# Altium project 474084-L.PrjPcb
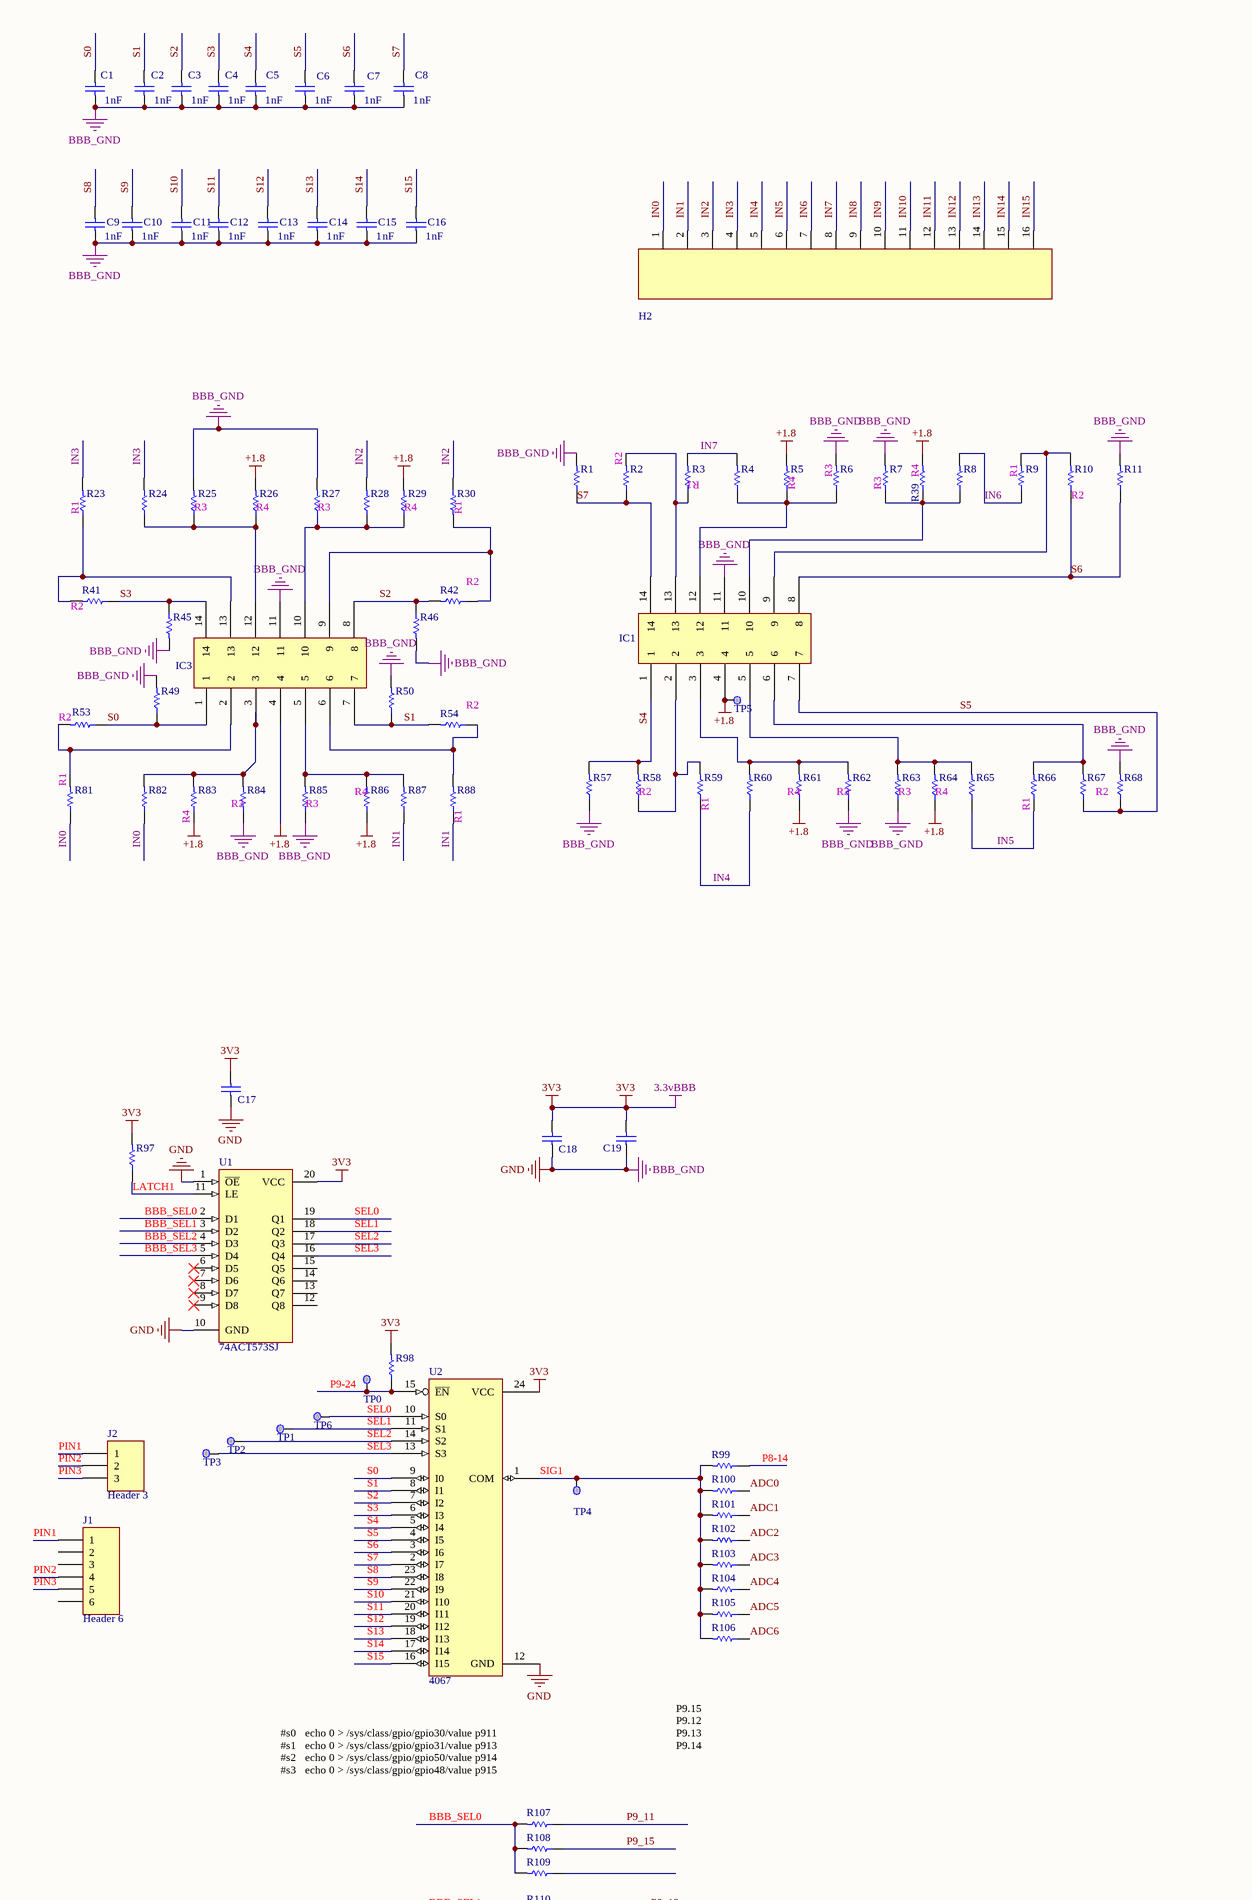
[diagram p0: BBB_ADC7_inputs_with_mux_Ver1 Rev1.SchDoc, top left]
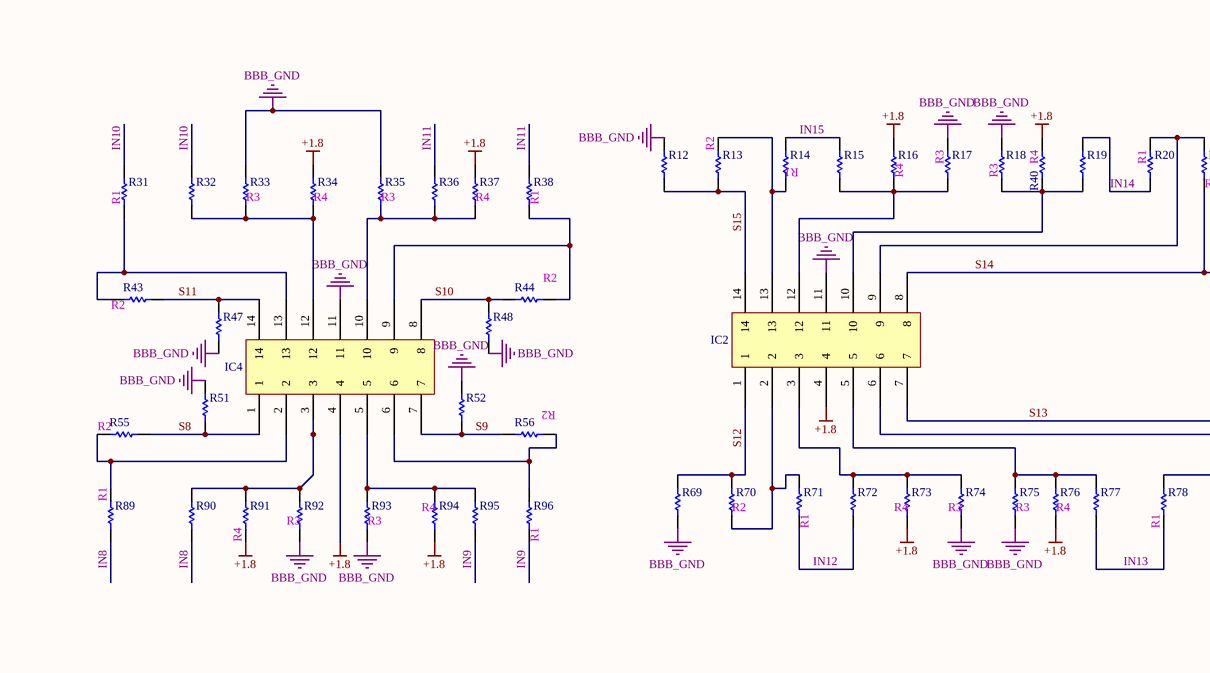
[diagram p1: BBB_ADC7_inputs_with_mux_Ver1 Rev1.SchDoc, top middle]
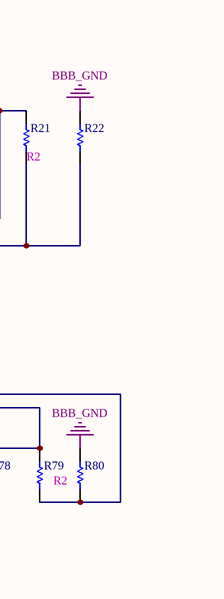
[diagram p2: BBB_ADC7_inputs_with_mux_Ver1 Rev1.SchDoc, top right]
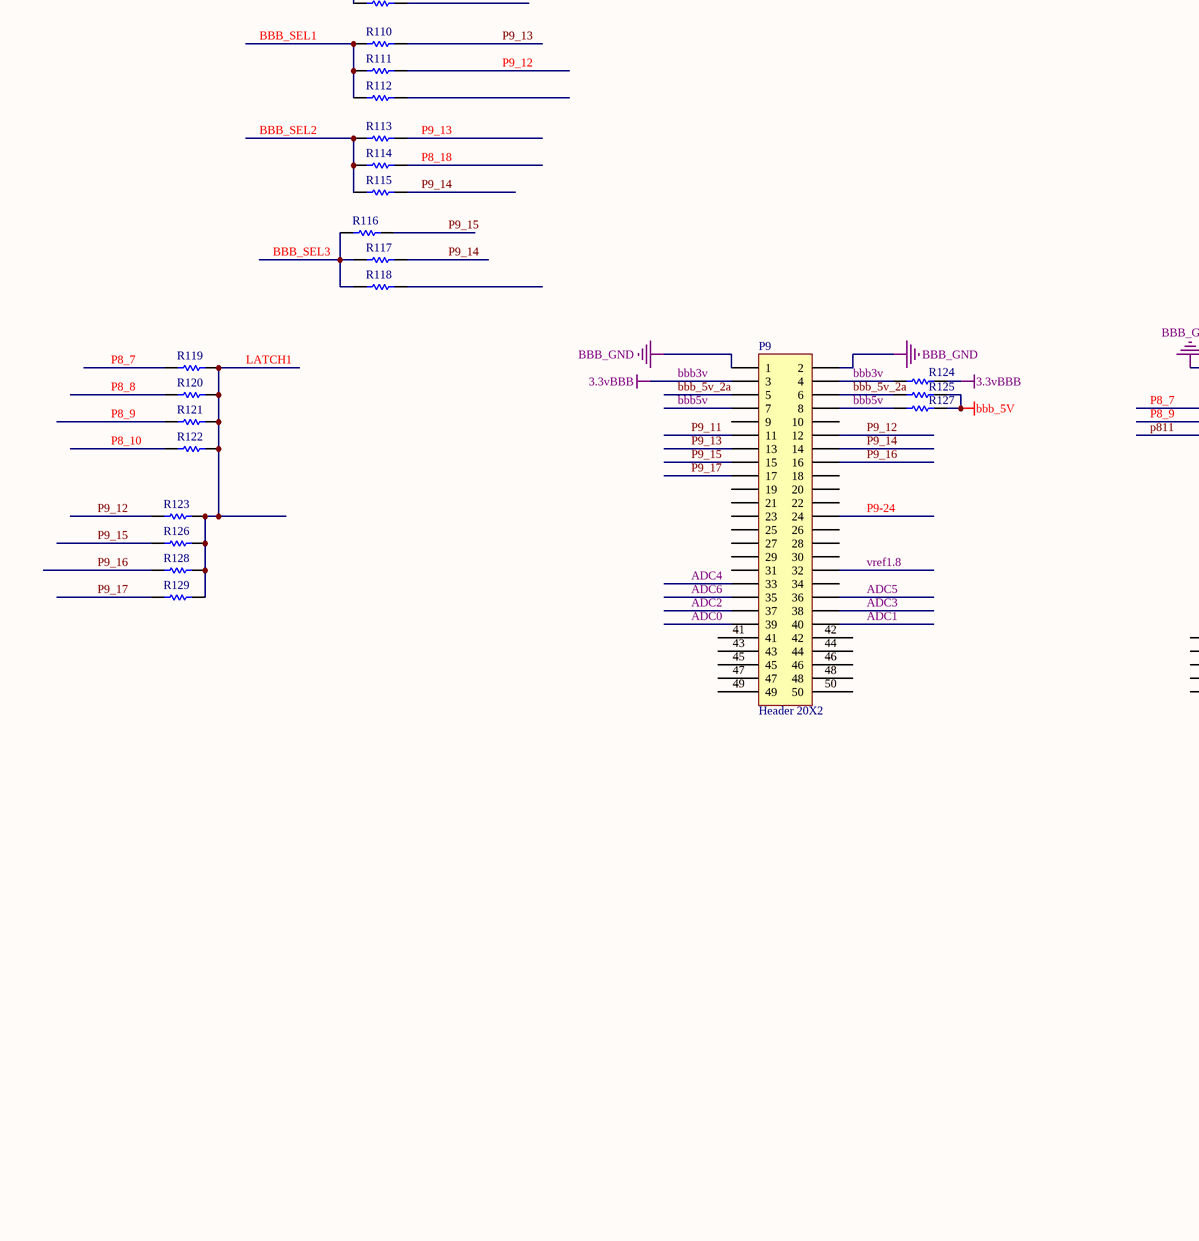
[diagram p3: BBB_ADC7_inputs_with_mux_Ver1 Rev1.SchDoc, bottom left]
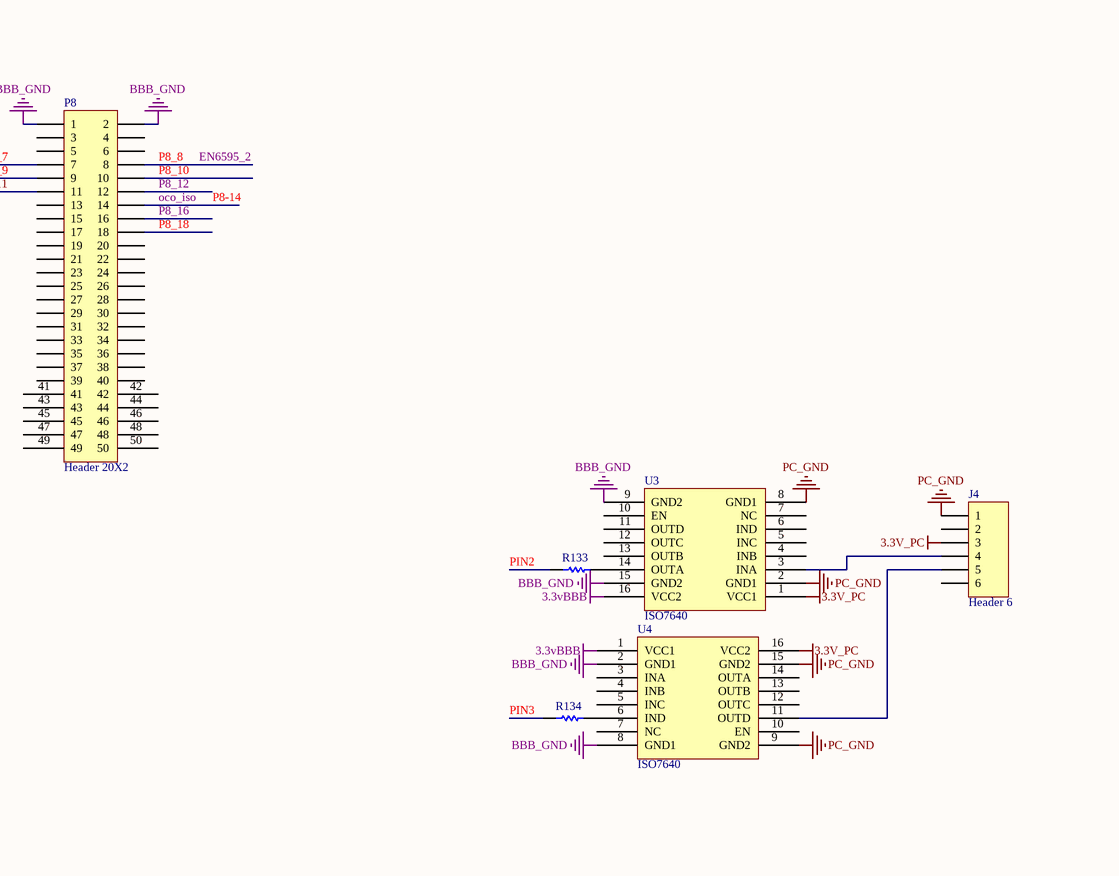
[diagram p4: BBB_ADC7_inputs_with_mux_Ver1 Rev1.SchDoc, bottom middle]
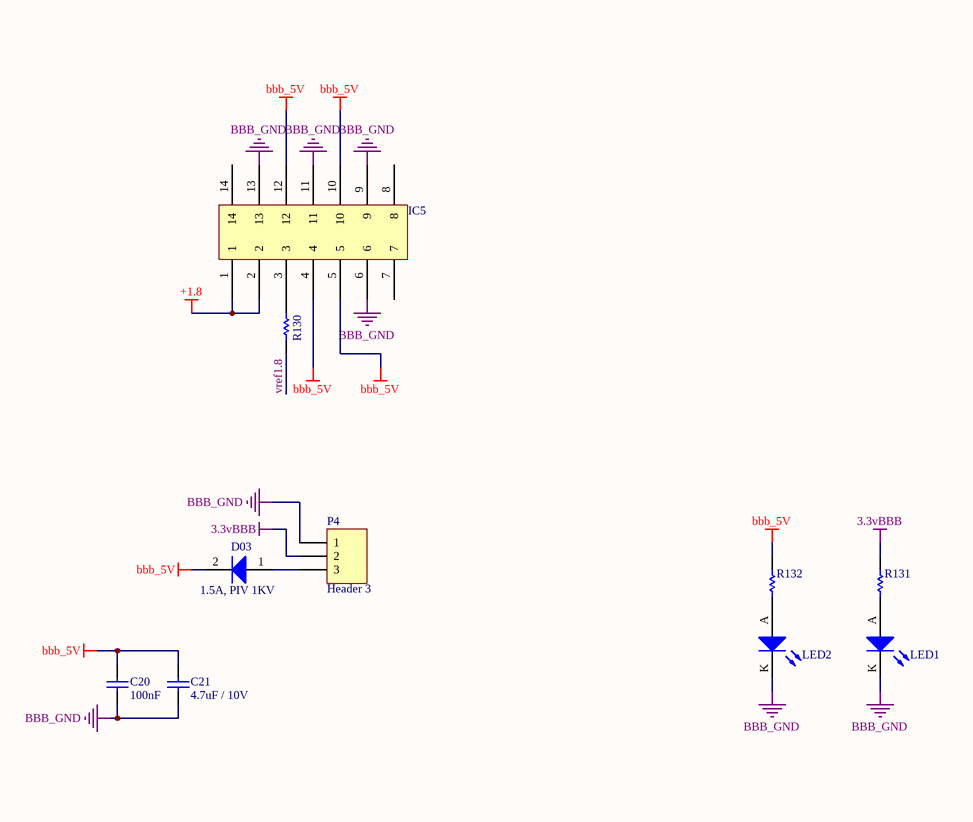
[diagram p5: BBB_ADC7_inputs_with_mux_Ver1 Rev1.SchDoc, bottom right]
1 sheet, 181 parts. Net scope: global (net labels, ports and power ports of the same name join across sheets).
Board file: BBB_ADC7_inputs_with_mux_Ver1 Rev1.PcbDoc

## Sheet BBB_ADC7_inputs_with_mux_Ver1 Rev1.SchDoc
size E

### Parts
C1  Units of Capacitance: nF  Capacitance: 1  [C0402]  (hidden comment: CAPACITOR NONPOLAR SMT)
C2  Units of Capacitance: nF  Capacitance: 1  [C0402]  (hidden comment: CAPACITOR NONPOLAR SMT)
C3  Units of Capacitance: nF  Capacitance: 1  [C0402]  (hidden comment: CAPACITOR NONPOLAR SMT)
C4  Units of Capacitance: nF  Capacitance: 1  [C0402]  (hidden comment: CAPACITOR NONPOLAR SMT)
C5  Units of Capacitance: nF  Capacitance: 1  [C0402]  (hidden comment: CAPACITOR NONPOLAR SMT)
C6  Units of Capacitance: nF  Capacitance: 1  [C0402]  (hidden comment: CAPACITOR NONPOLAR SMT)
C7  Units of Capacitance: nF  Capacitance: 1  [C0402]  (hidden comment: CAPACITOR NONPOLAR SMT)
C8  Units of Capacitance: nF  Capacitance: 1  [C0402]  (hidden comment: CAPACITOR NONPOLAR SMT)
C9  Units of Capacitance: nF  Capacitance: 1  [C0402]  (hidden comment: CAPACITOR NONPOLAR SMT)
C10  Units of Capacitance: nF  Capacitance: 1  [C0402]  (hidden comment: CAPACITOR NONPOLAR SMT)
C11  Units of Capacitance: nF  Capacitance: 1  [C0402]  (hidden comment: CAPACITOR NONPOLAR SMT)
C12  Units of Capacitance: nF  Capacitance: 1  [C0402]  (hidden comment: CAPACITOR NONPOLAR SMT)
C13  Units of Capacitance: nF  Capacitance: 1  [C0402]  (hidden comment: CAPACITOR NONPOLAR SMT)
C14  Units of Capacitance: nF  Capacitance: 1  [C0402]  (hidden comment: CAPACITOR NONPOLAR SMT)
C15  Units of Capacitance: nF  Capacitance: 1  [C0402]  (hidden comment: CAPACITOR NONPOLAR SMT)
C16  Units of Capacitance: nF  Capacitance: 1  [C0402]  (hidden comment: CAPACITOR NONPOLAR SMT)
C17  4.7uF, 10V  [C0603]  (value not drawn)
C18  4.7uF, 10V  [C0603]  (value not drawn)
C19  4.7uF, 10V  [C0603]  (value not drawn)
C20  100nF  [C0603]
C21  4.7uF / 10V  [C0603]
D03  1.5A, PIV 1KV  [DIODE_DO-214AA(SMB)]
H2  connector 16 pin male_ stright  [16 pin male stright]  (value not drawn)
IC1  OPamp  [SOIC-14]  (value not drawn)
IC2  OPamp  [SOIC-14]  (value not drawn)
IC3  OPamp  [SOIC-14]  (value not drawn)
IC4  OPamp  [SOIC-14]  (value not drawn)
IC5  OPamp  [SOIC-14]  (value not drawn)
J1  Header 6  [HDR1X6]
J2  Header 3  [HDR1X3]
J4  Header 6  [HDR1X6]
LED1  LED  [0537, LED, 1206]  (value not drawn)
LED2  LED  [0537, LED, 1206]  (value not drawn)
P4  Header 3  [HDR1X3]
P8  Header 20X2  [BBBHEADERNOHOLE]
P9  Header 20X2  [BBBHEADERNOHOLE]
R1  Resistor SMD 0603, 100 k Ohm, +/-5%, 1/10W  [0603]  (value not drawn)
R2  Resistor SMD 0603, 1.5 k Ohm, +/-5%, 1/10W  [0603]  (value not drawn)
R3  Resistor SMD 0603, 9.1 k Ohm, +/-5%, 1/10W  [0603]  (value not drawn)
R4  open  [0603]  (value not drawn)
R5  Resistor SMD 0603, 6.8 k Ohm, +/-1%, 1/10W  [0603]  (value not drawn)
R6  Resistor SMD 0603, 4.7 k Ohm, +/-5%, 1/10W  [0603]  (value not drawn)
R7  Resistor SMD 0603, 4.7 k Ohm, +/-5%, 1/10W  [0603]  (value not drawn)
R8  open  [0603]  (value not drawn)
R9  Resistor SMD 0603, 9.1 k Ohm, +/-5%, 1/10W  [0603]  (value not drawn)
R10  Resistor SMD 0603, 1.5 k Ohm, +/-5%, 1/10W  [0603]  (value not drawn)
R11  Resistor SMD 0603, 100 k Ohm, +/-5%, 1/10W  [0603]  (value not drawn)
R12  Resistor SMD 0603, 100 k Ohm, +/-5%, 1/10W  [0603]  (value not drawn)
R13  Resistor SMD 0603, 1.5 k Ohm, +/-5%, 1/10W  [0603]  (value not drawn)
R14  Resistor SMD 0603, 9.1 k Ohm, +/-5%, 1/10W  [0603]  (value not drawn)
R15  open  [0603]  (value not drawn)
R16  Resistor SMD 0603, 6.8 k Ohm, +/-1%, 1/10W  [0603]  (value not drawn)
R17  Resistor SMD 0603, 4.7 k Ohm, +/-5%, 1/10W  [0603]  (value not drawn)
R18  Resistor SMD 0603, 4.7 k Ohm, +/-5%, 1/10W  [0603]  (value not drawn)
R19  open  [0603]  (value not drawn)
R20  Resistor SMD 0603, 9.1 k Ohm, +/-5%, 1/10W  [0603]  (value not drawn)
R21  Resistor SMD 0603, 1.5 k Ohm, +/-5%, 1/10W  [0603]  (value not drawn)
R22  Resistor SMD 0603, 100 k Ohm, +/-5%, 1/10W  [0603]  (value not drawn)
R23  Resistor SMD 0603, 9.1 k Ohm, +/-5%, 1/10W  [0603]  (value not drawn)
R24  OPEN  [0603]  (value not drawn)
R25  Resistor SMD 0603, 4.7 k Ohm, +/-5%, 1/10W  [0603]  (value not drawn)
R26  Resistor SMD 0603, 6.8 k Ohm, +/-1%, 1/10W  [0603]  (value not drawn)
R27  Resistor SMD 0603, 4.7 k Ohm, +/-5%, 1/10W  [0603]  (value not drawn)
R28  OPEN  [0603]  (value not drawn)
R29  Resistor SMD 0603, 6.8 k Ohm, +/-1%, 1/10W  [0603]  (value not drawn)
R30  Resistor SMD 0603, 9.1 k Ohm, +/-5%, 1/10W  [0603]  (value not drawn)
R31  Resistor SMD 0603, 9.1 k Ohm, +/-5%, 1/10W  [0603]  (value not drawn)
R32  OPEN  [0603]  (value not drawn)
R33  Resistor SMD 0603, 4.7 k Ohm, +/-5%, 1/10W  [0603]  (value not drawn)
R34  Resistor SMD 0603, 6.8 k Ohm, +/-1%, 1/10W  [0603]  (value not drawn)
R35  Resistor SMD 0603, 4.7 k Ohm, +/-5%, 1/10W  [0603]  (value not drawn)
R36  OPEN  [0603]  (value not drawn)
R37  Resistor SMD 0603, 6.8 k Ohm, +/-1%, 1/10W  [0603]  (value not drawn)
R38  Resistor SMD 0603, 9.1 k Ohm, +/-5%, 1/10W  [0603]  (value not drawn)
R39  Resistor SMD 0603, 6.8 k Ohm, +/-1%, 1/10W  [0603]  (value not drawn)
R40  Resistor SMD 0603, 6.8 k Ohm, +/-1%, 1/10W  [0603]  (value not drawn)
R41  Resistor SMD 0603, 1.5 k Ohm, +/-5%, 1/10W  [0603]  (value not drawn)
R42  Resistor SMD 0603, 1.5 k Ohm, +/-5%, 1/10W  [0603]  (value not drawn)
R43  Resistor SMD 0603, 1.5 k Ohm, +/-5%, 1/10W  [0603]  (value not drawn)
R44  Resistor SMD 0603, 1.5 k Ohm, +/-5%, 1/10W  [0603]  (value not drawn)
R45  Resistor SMD 0603, 100 k Ohm, +/-5%, 1/10W  [0603]  (value not drawn)
R46  Resistor SMD 0603, 100 k Ohm, +/-5%, 1/10W  [0603]  (value not drawn)
R47  Resistor SMD 0603, 100 k Ohm, +/-5%, 1/10W  [0603]  (value not drawn)
R48  Resistor SMD 0603, 100 k Ohm, +/-5%, 1/10W  [0603]  (value not drawn)
R49  Resistor SMD 0603, 100 k Ohm, +/-5%, 1/10W  [0603]  (value not drawn)
R50  Resistor SMD 0603, 100 k Ohm, +/-5%, 1/10W  [0603]  (value not drawn)
R51  Resistor SMD 0603, 100 k Ohm, +/-5%, 1/10W  [0603]  (value not drawn)
R52  Resistor SMD 0603, 100 k Ohm, +/-5%, 1/10W  [0603]  (value not drawn)
R53  Resistor SMD 0603, 1.5 k Ohm, +/-5%, 1/10W  [0603]  (value not drawn)
R54  Resistor SMD 0603, 1.5 k Ohm, +/-5%, 1/10W  [0603]  (value not drawn)
R55  Resistor SMD 0603, 1.5 k Ohm, +/-5%, 1/10W  [0603]  (value not drawn)
R56  Resistor SMD 0603, 1.5 k Ohm, +/-5%, 1/10W  [0603]  (value not drawn)
R57  Resistor SMD 0603, 100 k Ohm, +/-5%, 1/10W  [0603]  (value not drawn)
R58  Resistor SMD 0603, 1.5 k Ohm, +/-5%, 1/10W  [0603]  (value not drawn)
R59  Resistor SMD 0603, 9.1 k Ohm, +/-5%, 1/10W  [0603]  (value not drawn)
R60  open  [0603]  (value not drawn)
R61  Resistor SMD 0603, 6.8 k Ohm, +/-1%, 1/10W  [0603]  (value not drawn)
R62  Resistor SMD 0603, 4.7 k Ohm, +/-5%, 1/10W  [0603]  (value not drawn)
R63  Resistor SMD 0603, 4.7 k Ohm, +/-5%, 1/10W  [0603]  (value not drawn)
R64  Resistor SMD 0603, 6.8 k Ohm, +/-1%, 1/10W  [0603]  (value not drawn)
R65  open  [0603]  (value not drawn)
R66  Resistor SMD 0603, 9.1 k Ohm, +/-5%, 1/10W  [0603]  (value not drawn)
R67  Resistor SMD 0603, 1.5 k Ohm, +/-5%, 1/10W  [0603]  (value not drawn)
R68  Resistor SMD 0603, 100 k Ohm, +/-5%, 1/10W  [0603]  (value not drawn)
R69  Resistor SMD 0603, 100 k Ohm, +/-5%, 1/10W  [0603]  (value not drawn)
R70  Resistor SMD 0603, 1.5 k Ohm, +/-5%, 1/10W  [0603]  (value not drawn)
R71  Resistor SMD 0603, 9.1 k Ohm, +/-5%, 1/10W  [0603]  (value not drawn)
R72  open  [0603]  (value not drawn)
R73  Resistor SMD 0603, 6.8 k Ohm, +/-1%, 1/10W  [0603]  (value not drawn)
R74  Resistor SMD 0603, 4.7 k Ohm, +/-5%, 1/10W  [0603]  (value not drawn)
R75  Resistor SMD 0603, 4.7 k Ohm, +/-5%, 1/10W  [0603]  (value not drawn)
R76  Resistor SMD 0603, 6.8 k Ohm, +/-1%, 1/10W  [0603]  (value not drawn)
R77  open  [0603]  (value not drawn)
R78  Resistor SMD 0603, 9.1 k Ohm, +/-5%, 1/10W  [0603]  (value not drawn)
R79  Resistor SMD 0603, 1.5 k Ohm, +/-5%, 1/10W  [0603]  (value not drawn)
R80  Resistor SMD 0603, 100 k Ohm, +/-5%, 1/10W  [0603]  (value not drawn)
R81  Resistor SMD 0603, 9.1 k Ohm, +/-5%, 1/10W  [0603]  (value not drawn)
R82  OPEN  [0603]  (value not drawn)
R83  Resistor SMD 0603, 6.8 k Ohm, +/-1%, 1/10W  [0603]  (value not drawn)
R84  Resistor SMD 0603, 4.7 k Ohm, +/-5%, 1/10W  [0603]  (value not drawn)
R85  Resistor SMD 0603, 4.7 k Ohm, +/-5%, 1/10W  [0603]  (value not drawn)
R86  Resistor SMD 0603, 6.8 k Ohm, +/-1%, 1/10W  [0603]  (value not drawn)
R87  OPEN  [0603]  (value not drawn)
R88  Resistor SMD 0603, 9.1 k Ohm, +/-5%, 1/10W  [0603]  (value not drawn)
R89  Resistor SMD 0603, 9.1 k Ohm, +/-5%, 1/10W  [0603]  (value not drawn)
R90  OPEN  [0603]  (value not drawn)
R91  Resistor SMD 0603, 6.8 k Ohm, +/-1%, 1/10W  [0603]  (value not drawn)
R92  Resistor SMD 0603, 4.7 k Ohm, +/-5%, 1/10W  [0603]  (value not drawn)
R93  Resistor SMD 0603, 4.7 k Ohm, +/-5%, 1/10W  [0603]  (value not drawn)
R94  Resistor SMD 0603, 6.8 k Ohm, +/-1%, 1/10W  [0603]  (value not drawn)
R95  OPEN  [0603]  (value not drawn)
R96  Resistor SMD 0603, 9.1 k Ohm, +/-5%, 1/10W  [0603]  (value not drawn)
R97  (no value)  [0603]
R98  1Kohm  [0603]  (value not drawn)
R99  1Kohm  [0603]  (value not drawn)
R100  1Kohm  [0603]  (value not drawn)
R101  1Kohm  [0603]  (value not drawn)
R102  1Kohm  [0603]  (value not drawn)
R103  1Kohm  [0603]  (value not drawn)
R104  1Kohm  [0603]  (value not drawn)
R105  1Kohm  [0603]  (value not drawn)
R106  1Kohm  [0603]  (value not drawn)
R107  (no value)  [0603]
R108  (no value)  [0603]
R109  (no value)  [0603]
R110  (no value)  [0603]
R111  (no value)  [0603]
R112  (no value)  [0603]
R113  (no value)  [0603]
R114  (no value)  [0603]
R115  (no value)  [0603]
R116  (no value)  [0603]
R117  (no value)  [0603]
R118  (no value)  [0603]
R119  1Kohm  [0603]  (value not drawn)
R120  1Kohm  [0603]  (value not drawn)
R121  1Kohm  [0603]  (value not drawn)
R122  1Kohm  [0603]  (value not drawn)
R123  1Kohm  [0603]  (value not drawn)
R124  Resistor SMD 0603, 0 Ohm, +/-5%, 1/10W  [0603]  (value not drawn)
R125  Resistor SMD 0603, 0 Ohm, +/-5%, 1/10W  [0603]  (value not drawn)
R126  1Kohm  [0603]  (value not drawn)
R127  Resistor SMD 0603, 0 Ohm, +/-5%, 1/10W  [0603]  (value not drawn)
R128  1Kohm  [0603]  (value not drawn)
R129  1Kohm  [0603]  (value not drawn)
R130  Resistor SMD 0603, 0 Ohm, +/-5%, 1/10W  [0603]  (value not drawn)
R131  Resistor SMD 0603, 4.7 k Ohm, +/-5%, 1/10W  [0603]  (value not drawn)
R132  Resistor SMD 0603, 4.7 k Ohm, +/-5%, 1/10W  [0603]  (value not drawn)
R133  Resistor SMD 0603, 0 Ohm, +/-5%, 1/10W  [0603]  (value not drawn)
R134  Resistor SMD 0603, 0 Ohm, +/-5%, 1/10W  [0603]  (value not drawn)
TP0  TEST PAD  [TP]  (value not drawn)
TP1  TEST PAD  [TP]  (value not drawn)
TP2  TEST PAD  [TP]  (value not drawn)
TP3  TEST PAD  [TP]  (value not drawn)
TP4  TEST PAD  [TP]  (value not drawn)
TP5  TEST PAD  [TP]  (value not drawn)
TP6  TEST PAD  [TP]  (value not drawn)
U1  74ACT573SJ  [sol-20]
U2  4067  [SSOP-24]
U3  ISO7640  [SOIC-16]
U4  ISO7640  [SOIC-16]

### Nets
3.3V_PC: J4.3 U3.1(VCC1) U4.16(VCC2)
+1.8: IC1.4 IC2.4 IC3.4 IC4.4 IC5.1 IC5.2 R5.2 R16.2 R26.2 R29.2 R34.2 R37.2 R39.2 R40.2 R61.1 R64.1 R73.1 R76.1 R83.1 R86.1 R91.1 R94.1 TP5.1
bbb3v: C17.1 C18.1 C19.1 P4.2 P9.3 P9.4 R97.2 R98.2 R124.1 R124.2 R131.2 U1.20(VCC) U2.24(VCC) U3.16(VCC2) U4.1(VCC1)  [also labelled 3.3vBBB, 3V3]
bbb_5V: C20.1 C21.1 D03.2 IC5.4 IC5.5 IC5.10 IC5.12 R125.1 R127.1 R132.2
BBB_GND: C1.2 C2.2 C3.2 C4.2 C5.2 C6.2 C7.2 C8.2 C9.2 C10.2 C11.2 C12.2 C13.2 C14.2 C15.2 C16.2 C17.2 C18.2 C19.2 C20.2 C21.2 IC1.11 IC2.11 IC3.11 IC4.11 IC5.6 IC5.9 IC5.11 IC5.13 LED1.K LED2.K P4.1 P8.1 P8.2 P9.1 P9.2 R1.2 R6.2 R7.2 R11.2 R12.2 R17.2 R18.2 R22.2 R25.2 R27.2 R33.2 R35.2 R45.2 R46.2 R47.2 R48.2 R49.2 R50.2 R51.2 R52.2 R57.1 R62.1 R63.1 R68.2 R69.1 R74.1 R75.1 R80.2 R84.1 R85.1 R92.1 R93.1 U1.1(~{OE}) U1.10(GND) U2.12(GND) U3.9(GND2) U3.15(GND2) U4.2(GND1) U4.8(GND1)  [also labelled GND]
PC_GND: J4.1 U3.2(GND1) U3.8(GND1) U4.9(GND2) U4.15(GND2)
ADC0: P9.39 R100.1
ADC1: P9.40 R101.1
ADC2: P9.37 R102.1
ADC3: P9.38 R103.1
ADC4: P9.33 R104.1
ADC5: P9.36 R105.1
ADC6: P9.35 R106.1
bbb5v: P9.7 P9.8 R127.2
bbb_5v_2a: P9.5 P9.6 R125.2
BBB_SEL0: R107.2 R108.2 R109.2 U1.2(D1)
BBB_SEL1: R110.2 R111.2 R112.2 U1.3(D2)
BBB_SEL2: R113.2 R114.2 R115.2 U1.4(D3)
BBB_SEL3: R116.2 R117.2 R118.2 U1.5(D4)
EN6595_2: P8.8 R120.2  [also labelled P8_8]
IN0: H2.1 R81.1 R82.1
IN1: H2.2 R87.1 R88.1
IN2: H2.3 R28.2 R30.1
IN3: H2.4 R23.2 R24.2
IN4: H2.5 R59.1 R60.1
IN5: H2.6 R65.1 R66.1
IN6: H2.7 R8.2 R9.1
IN7: H2.8 R3.2 R4.2
IN8: H2.9 R89.1 R90.1
IN9: H2.10 R95.1 R96.1
IN10: H2.11 R31.2 R32.2
IN11: H2.12 R36.2 R38.1
IN12: H2.13 R71.1 R72.1
IN13: H2.14 R77.1 R78.1
IN14: H2.15 R19.2 R20.1
IN15: H2.16 R14.2 R15.2
LATCH1: R97.1 R119.1 R120.1 R121.1 R122.1 R123.1 R126.1 R128.1 R129.1 U1.11(LE)
oco_iso: P8.14 R99.1  [also labelled P8-14]
P8_7: P8.7 R119.2
P8_9: P8.9 R121.2
P8_10: P8.10 R122.2
P8_12: P8.12
P8_16: P8.16
P8_18: P8.18 R114.1
P9-24: P9.24 R98.1 TP0.1 U2.15(~{EN})
P9_11: P9.11 R107.1
P9_12: P9.12 R111.1 R123.2
P9_13: P9.13 R110.1 R113.1
P9_14: P9.14 R115.1 R117.1
P9_15: P9.15 R108.1 R116.1 R126.2
P9_16: P9.16 R128.2
P9_17: P9.17 R129.2
p811: P8.11
PIN1: J1.1 J2.1
PIN2: J1.4 J2.2 R133.2
PIN3: J1.5 J2.3 R134.2
S0: C1.1 IC3.1 R49.1 R53.1 U2.9(I0)
S1: C2.1 IC3.7 R50.1 R54.2 U2.8(I1)
S2: C3.1 IC3.8 R42.2 R46.1 U2.7(I2)
S3: C4.1 IC3.14 R41.1 R45.1 U2.6(I3)
S4: C5.1 IC1.1 R57.2 R58.2 U2.5(I4)
S5: C6.1 IC1.7 R67.1 R68.1 U2.4(I5)
S6: C7.1 IC1.8 R10.1 R11.1 U2.3(I6)
S7: C8.1 IC1.14 R1.1 R2.1 U2.2(I7)
S8: C9.1 IC4.1 R51.1 R55.1 U2.23(I8)
S9: C10.1 IC4.7 R52.1 R56.2 U2.22(I9)
S10: C11.1 IC4.8 R44.2 R48.1 U2.21(I10)
S11: C12.1 IC4.14 R43.1 R47.1 U2.20(I11)
S12: C13.1 IC2.1 R69.2 R70.2 U2.19(I12)
S13: C14.1 IC2.7 R79.1 R80.1 U2.18(I13)
S14: C15.1 IC2.8 R21.1 R22.1 U2.17(I14)
S15: C16.1 IC2.14 R12.1 R13.1 U2.16(I15)
SEL0: TP6.1 U1.19(Q1) U2.10(S0)
SEL1: TP1.1 U1.18(Q2) U2.11(S1)
SEL2: TP2.1 U1.17(Q3) U2.14(S2)
SEL3: TP3.1 U1.16(Q4) U2.13(S3)
SIG1: R99.2 R100.2 R101.2 R102.2 R103.2 R104.2 R105.2 R106.2 TP4.1 U2.1(COM)
vref1.8: P9.32 R130.1
NetD03_1: D03.1 P4.3
NetIC1_2: IC1.2 R58.1 R59.2
NetIC1_3: IC1.3 R60.2 R61.2 R62.2
NetIC1_5: IC1.5 R63.2 R64.2 R65.2
NetIC1_6: IC1.6 R66.2 R67.2
NetIC1_9: IC1.9 R9.2 R10.2
NetIC1_10: IC1.10 R7.1 R8.1 R39.1
NetIC1_12: IC1.12 R4.1 R5.1 R6.1
NetIC1_13: IC1.13 R2.2 R3.1
NetIC2_2: IC2.2 R70.1 R71.2
NetIC2_3: IC2.3 R72.2 R73.2 R74.2
NetIC2_5: IC2.5 R75.2 R76.2 R77.2
NetIC2_6: IC2.6 R78.2 R79.2
NetIC2_9: IC2.9 R20.2 R21.2
NetIC2_10: IC2.10 R18.1 R19.1 R40.1
NetIC2_12: IC2.12 R15.1 R16.1 R17.1
NetIC2_13: IC2.13 R13.2 R14.1
NetIC3_2: IC3.2 R53.2 R81.2
NetIC3_3: IC3.3 R82.2 R83.2 R84.2
NetIC3_5: IC3.5 R85.2 R86.2 R87.2
NetIC3_6: IC3.6 R54.1 R88.2
NetIC3_9: IC3.9 R30.2 R42.1
NetIC3_10: IC3.10 R27.1 R28.1 R29.1
NetIC3_12: IC3.12 R24.1 R25.1 R26.1
NetIC3_13: IC3.13 R23.1 R41.2
NetIC4_2: IC4.2 R55.2 R89.2
NetIC4_3: IC4.3 R90.2 R91.2 R92.2
NetIC4_5: IC4.5 R93.2 R94.2 R95.2
NetIC4_6: IC4.6 R56.1 R96.2
NetIC4_9: IC4.9 R38.2 R44.1
NetIC4_10: IC4.10 R35.1 R36.1 R37.1
NetIC4_12: IC4.12 R32.1 R33.1 R34.1
NetIC4_13: IC4.13 R31.1 R43.2
NetIC5_3: IC5.3 R130.2
NetJ4_4: J4.4 U3.3(INA)
NetJ4_5: J4.5 U4.11(OUTD)
NetLED1_A: LED1.A R131.1
NetLED2_A: LED2.A R132.1
NetR133_1: R133.1 U3.14(OUTA)
NetR134_1: R134.1 U4.6(IND)

Not connected (* = marked no-connect by the designer): IC5 7 8 14; J1 2 3 6; J4 2 6; P8 3 4 5 6 13 15 17 19 20 21 22 23 24 25 26 27 28 29 30 31 32 33 34 35 36 37 38 39 40 41 42 43 44 45 46 47 48 49 50; P9 9 10 18 19 20 21 22 23 25 26 27 28 29 30 31 34 41 42 43 44 45 46 47 48 49 50; R109 1; R112 1; R118 1; U1 6(D5)* 7(D6)* 8(D7)* 9(D8)* 12(Q8) 13(Q7) 14(Q6) 15(Q5); U3 4(INB) 5(INC) 6(IND) 7(NC) 10(EN) 11(OUTD) 12(OUTC) 13(OUTB); U4 3(INA) 4(INB) 5(INC) 7(NC) 10(EN) 12(OUTC) 13(OUTB) 14(OUTA)

### Notes on the sheet
- (near R2) R2
- (near R3) R1
- (near R5) R4
- (near R6) R3
- (near R7) R3
- (near R39) R4
- (near R9) R1
- (near R10) R2
- (near R13) R2
- (near R14) R1
- (near R16) R4
- (near R17) R3
- (near R18) R3
- (near R40) R4
- (near R20) R1
- (near R21) R2
- (near R23) R1
- (near R25) R3
- (near R26) R4
- (near R27) R3
- (near R29) R4
- (near R30) R1
- (near R31) R1
- (near R33) R3
- (near R34) R4
- (near R35) R3
- (near R37) R4
- (near R38) R1
- (near R41) R2
- (near R42) R2
- (near R43) R2
- (near R44) R2
- (near R53) R2
- (near R54) R2
- (near R55) R2
- (near R56) R2
- (near R81) R1
- (near R84) R3
- (near R85) R3
- (near R86) R4
- (near R58) R2
- (near R59) R1
- (near R61) R4
- (near R62) R3
- (near R63) R3
- (near R64) R4
- (near R66) R1
- R2
- (near R89) R1
- (near R92) R3
- (near R93) R3
- (near R94) R4
- (near R70) R2
- (near R71) R1
- (near R73) R4
- (near R74) R3
- (near R75) R3
- (near R76) R4
- (near R78) R1
- (near R83) R4
- (near R88) R1
- (near R91) R4
- (near R96) R1
- (near R107) #s0   echo 0 > /sys/class/gpio/gpio30/value p911
  #s1   echo 0 > /sys/class/gpio/gpio31/value p913
  #s2   echo 0 > /sys/class/gpio/gpio50/value p914
  #s3   echo 0 > /sys/class/gpio/gpio48/value p915
- P9.15
  P9.12
  P9.13
  P9.14

### Library data of the parts
C1-C16 = BCS22A-102: Capacitor ceramic, SMD 0402, 1 nF, +/-10%, 50 V dc; Mfr Name: YAGEO; Secure Use Status: Preferred; Voltage Rating: 50; Units of Voltage: V dc; Dielectric: X7R; Value(Farad): 1n; Published: 8-Jun-2000; LatestRevisionDate: 17-Jul-2002; LatestRevisionNote: Re-released for DXP Platform.; PackageReference: C1206; Publisher: Altium Limited; SMLPARTNO: BCS22A-102; Tolerance (%): +/-10%; Application: Filtering; Coupling & Decoupling; Life Cycle: Production; Package: 0402; Mounting Type: SMD; Sub Category: Ceramic; HelpURL: http://dataudr.udp.sml.com/DataSheet/EX0351-121-R39.pdf
C17-C19 C21 = BCS129-475: Capacitor ceramic, SMD 0603, 4.7 uF, +/-10%, 10 V dc; Mfr Name: KEMET; Secure Use Status: Authorization Required; Voltage Rating: 10; Units of Voltage: V dc; Capacitance: 4.7; Dielectric: X5R; 3D Model: Not Required; Published: 8-Jun-2000; LatestRevisionDate: 17-Jul-2002; LatestRevisionNote: Re-released for DXP Platform.; PackageReference: C1206; Publisher: Altium Limited; SMLPARTNO: BCS129-475; Tolerance (%): +/-10%; Application: Filtering, Coupling & Decoupling; Life Cycle: Pur Qual; Units of Capacitance: uF; Package: 0603; Mounting Type: SMD; Sub Category: Ceramic
C20 = BCS129-104: Capacitor ceramic, SMD 0603, 100 nF, +/-10%, 16 V dc; Mfr Name: KEMET; Units of Voltage: V dc; Value(Farad): 100n; Voltage Rating: 16; Dielectric: X7R; Capacitance: 100; Published: 8-Jun-2000; LatestRevisionDate: 17-Jul-2002; LatestRevisionNote: Re-released for DXP Platform.; PackageReference: C1206; Publisher: Altium Limited; SMLPARTNO: BCS129-104; Life Cycle: Production; Package: 0603; Application: Filtering; Coupling & Decoupling; Mounting Type: SMD; Units of Capacitance: nF; Tolerance (%): +/-10%; Sub Category: Ceramic
D03 = BDS334-001: Diode high voltage, SMD DO-214AA, If 1.5 A, PIV 1 kV; Mfr Name: VISHAY; Secure Use Status: Authorization Required; Peak Inverse Voltage: 1; Average Forward Current: 1.5; Published: 8-Jun-2000; LatestRevisionDate: 17-Jul-2002; LatestRevisionNote: Re-released for DXP Platform.; PackageDocument: Sep-1996; PackageReference: SMC; Publisher: Altium Limited; Code_JEDEC: DO-214-AB; SMLPARTNO: BDS334-001; Units of Voltage: kV; Life Cycle: Production; Units of Current: A; Mounting Type: SMD; HelpURL: http://dataudr.udp.sml.com/DataSheet/EX0551-218-R00.pdf; Sub Category: High Voltage; Package: DO-214AA
IC1-IC4 = OPamp: SMLPARTNO: BIS114-020
IC5 = OPamp: SMLPPARTNO: BIS114-020
J1 J4 = Header 6: Header, 6-Pin; LatestRevisionDate: 17-Jul-2002; LatestRevisionNote: Re-released for DXP Platform.; Publisher: Altium Limited
J2 P4 = Header 3: Header, 3-Pin; LatestRevisionDate: 17-Jul-2002; LatestRevisionNote: Re-released for DXP Platform.; Publisher: Altium Limited
LED1 LED2 = BDS461-001: Optoelectronic LED, SMD 1206, red colour; Mfr Name: AVAGO TECHNOLOGIES; SMLPARTNO: BDS461-001; Life Cycle: Production; Package: 1206; Mounting Type: SMD; Sub Category: LED; Published: 8-Jun-2000; LatestRevisionDate: 08-Jul-2005; LatestRevisionNote: Mech Layer 1 removed.; PackageReference: LED-0; Publisher: Altium Limited; LED Colour: Red
P8 P9 = Header 20X2: Header, 20-Pin, Dual row; LatestRevisionDate: 17-Jul-2002; LatestRevisionNote: Re-released for DXP Platform.; Publisher: Altium Limited
R1 R11 R12 R22 R45-R52 R57 R68 R69 R80 = BRS133-473: SMLPARTNO: BRS131-104; Mfr Name: VISHAY; Sub Category: Thick Film; Tempco1: 0.0002; Unit Of Resistance: k Ohm; Value(ohm): 100; Life Cycle: Obsolete; Package: 0603; Mounting Type: SMD; Tolerance: +/-5%; Power Rating: 1/10W
R2 R13 R41-R44 R53-R56 R58 R67 R70 R79 = BRS133-473: SMLPARTNO: BRS131-152; Mfr Name: VISHAY; Sub Category: Thick Film; Tempco1: 0.0002; Unit Of Resistance: k Ohm; Value(ohm): 1.5; Life Cycle: Obsolete; Package: 0603; Mounting Type: SMD; Tolerance: +/-5%; Power Rating: 1/10W
R3 R9 R14 R20 R30 R38 R66 R78 R81 R88 R89 R96 = BRS133-473: SMLPARTNO: BRS131-912; Mfr Name: VISHAY; Sub Category: Thick Film; Tempco1: 0.0002; Unit Of Resistance: k Ohm; Value(ohm): 9.1; Life Cycle: Obsolete; Package: 0603; Mounting Type: SMD; Tolerance: +/-5%; Power Rating: 1/10W
R4 R8 R15 R19 R24 R28 R32 R36 R60 R72 R82 R87 R90 R95 = BRS133-473: Mfr Name: VISHAY; Sub Category: Thick Film; Tempco1: 0.0002; Tolerance: +/-5%; Power Rating: 1/10W; Life Cycle: Obsolete; Package: 0603; Mounting Type: SMD
R5 R16 R26 R34 R39 R40 R61 R64 R73 R76 R86 R94 = BRS133-473: SMLPARTNO: BRS131-682; Mfr Name: VISHAY; Sub Category: Thick Film; Tempco1: 0.0002; Unit Of Resistance: k Ohm; Value(ohm): 6.5; Tolerance: +/-5%; Life Cycle: Obsolete; Package: 0603; Mounting Type: SMD; Power Rating: 1/10W
R6 R7 R17 R18 R25 R27 R33 R35 R62 R63 R74 R75 R84 R85 R92 R93 = BRS133-473: SMLPARTNO: BRS133-472; Mfr Name: VISHAY; Sub Category: Thick Film; Tempco1: 0.0002; Unit Of Resistance: k Ohm; Value(ohm): 4.7; Life Cycle: Obsolete; Package: 0603; Mounting Type: SMD; Tolerance: +/-5%; Power Rating: 1/10W
R10 R21 = BRS133-473: SMLPARTNO: BRS131-152; Mfr Name: VISHAY; Sub Category: Thick Film; Resistance: 47; Tempco1: 0.0002; Unit Of Resistance: k Ohm; Value(ohm): 1.5; Life Cycle: Obsolete; Package: 0603; Mounting Type: SMD; Tolerance: +/-5%; Power Rating: 1/10W
R23 R31 = BRS133-473: SMLPARTNO: BRS131-912; Mfr Name: VISHAY; Sub Category: Thick Film; Resistance: 47; Tempco1: 0.0002; Unit Of Resistance: k Ohm; Value(ohm): 9.1; Life Cycle: Obsolete; Package: 0603; Mounting Type: SMD; Tolerance: +/-5%; Power Rating: 1/10W
R29 R37 R83 R91 = BRS133-473: SMLPARTNO: BRS131-682; Mfr Name: VISHAY; Sub Category: Thick Film; Resistance: 47; Tempco1: 0.0002; Unit Of Resistance: k Ohm; Value(ohm): 6.5; Tolerance: +/-5%; Life Cycle: Obsolete; Package: 0603; Mounting Type: SMD; Power Rating: 1/10W
R59 R71 = BRS133-473: SMLPARTNO: BRS133-902; Mfr Name: VISHAY; Sub Category: Thick Film; Tempco1: 0.0002; Unit Of Resistance: k Ohm; Value(ohm): 9.2; Life Cycle: Obsolete; Package: 0603; Mounting Type: SMD; Tolerance: +/-5%; Power Rating: 1/10W
R65 R77 = BRS133-473: Mfr Name: VISHAY; Sub Category: Thick Film; Tempco1: 0.0002; Unit Of Resistance: k Ohm; Tolerance: +/-5%; Power Rating: 1/10W; Life Cycle: Obsolete; Package: 0603; Mounting Type: SMD
R97 R107-R118 = BRS132-472: Resistor SMD 0603, 0 Ohm, +/-5%, 1/10W; SMLPARTNO: BRS132-000; Mfr Name: YAGEO; Sub Category: Thick Film; Resistance: 0; Tempco1: 0.0001; Unit Of Resistance: k Ohm; Value(ohm): 4.7k; Life Cycle: Obsolete; Package: 0603; Mounting Type: SMD; Tolerance: +/-5%; Power Rating: 1/10W
R98-R106 R119-R123 R126 R128 R129 = BRS831-102: Resistor SMD 0603, 1 k Ohm, +/-1%, 1/10W; Mfr Name: YAGEO; Sub Category: Thin Film; Resistance: 1; Tempco1: 0.00005; Unit Of Resistance: k Ohm; Value(ohm): 1k; SMLPARTNO: BRS831-102; Life Cycle: Production; Package: 0603; Mounting Type: SMD; Tolerance: +/-1%; Power Rating: 1/10W
R124 R125 R127 R133 R134 = BRS133-473: SMLPARTNO: BRS133-000; Mfr Name: VISHAY; Sub Category: Thick Film; Tempco1: 0.0002; Value(ohm): 0; Life Cycle: Obsolete; Package: 0603; Mounting Type: SMD; Tolerance: +/-5%; Power Rating: 1/10W
  R125 R127 R133 R134: Unit Of Resistance: Ohm
R130 = BRS133-473: SMLPARTNO: BRS133-000; Mfr Name: VISHAY; Sub Category: Thick Film; Resistance: 47; Tempco1: 0.0002; Value(ohm): 0; Life Cycle: Obsolete; Package: 0603; Mounting Type: SMD; Unit Of Resistance: Ohm; Tolerance: +/-5%; Power Rating: 1/10W
R131 R132 = BRS831-102: SMLPARTNO: BRS133-472; Mfr Name: YAGEO; Sub Category: Thin Film; Tempco1: 0.00005; Unit Of Resistance: k Ohm; Value(ohm): 4.7; Tolerance: +/-1%; Life Cycle: Production; Package: 0603; Mounting Type: SMD; Power Rating: 1/10W
U1 = 74ACT573SJ: Octal Latch with 3-State Output; Published: 17-Jul-2002; LatestRevisionDate: 13-Apr-2006; LatestRevisionNote: IPC-7351 Footprint Added.; DatasheetVersion: Oct-1999; PackageVersion: 2000; PackageReference: M20D; Publisher: Altium Limited; PackageDescription: 20-Pin Small Outline Package 1.27 mm Pitch; ComponentLink1Description: Manufacturer Link; ComponentLink1URL: http://www.fairchildsemi.com/; ComponentLink2Description: Datasheet; ComponentLink2URL: http://www.fairchildsemi.com/ds/74%2F74ACT573.pdf
U2 = MUX-74HC4067
U3 U4 = BIS116-038: IC digital isolator SMD SOIC-16, ISO7640; Mfr Name: TEXAS INSTRUMENTS; LED Colour: Not Applicable; 3D Model: Required; Sub Category: Opto Coupler; SMLPARTNO: BIS116-038; Life Cycle: Production; Mounting Type: SMD; Package: SOIC